# EAGLE design Smoker (EAGLE 6.5.0)
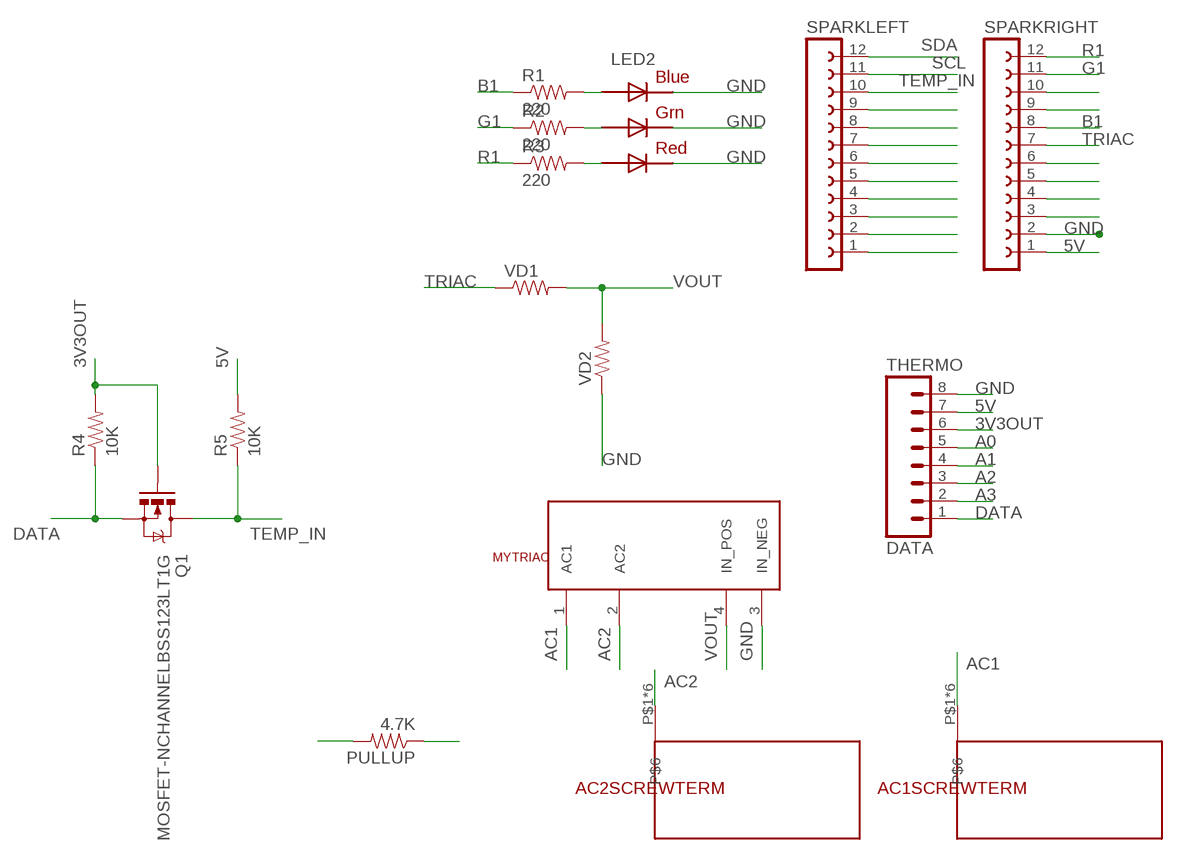
[diagram p0: schematic, sheet 1]

## Parts
AC1SCREWTERM  SCREW_TERM_8197  [SCREW_TERM_8197]
AC2SCREWTERM  SCREW_TERM_8197  [SCREW_TERM_8197]
LED2  RGBLED5050  [RGBLED5050]
MYTRIAC  S116S01  [S116S01]
PULLUP  4.7K  RESISTOR0805-RES  [0805]
Q1  MOSFET-NCHANNELBSS123LT1G  [SOT23]
R1  220  RESISTOR0805-RES  [0805]
R2  220  RESISTOR0805-RES  [0805]
R3  220  RESISTOR0805-RES  [0805]
R4  10K  RESISTOR0805-RES  [0805]
R5  10K  RESISTOR0805-RES  [0805]
SPARKLEFT  FE12-1  [FE12]
SPARKRIGHT  FE12-1  [FE12]
THERMO  DATA  M081X08  [1X08]
VD1  RESISTOR0805-RES  [0805]
VD2  RESISTOR0805-RES  [0805]

## Nets
3V3OUT: PULLUP.1 Q1.1(G) R4.2 THERMO.6
5V: R5.2 SPARKRIGHT.1 THERMO.7
A0: THERMO.5
A1: THERMO.4
A2: THERMO.3
A3: THERMO.2
AC1: AC1SCREWTERM.P$1 AC1SCREWTERM.P$2 AC1SCREWTERM.P$3 AC1SCREWTERM.P$4 AC1SCREWTERM.P$5 AC1SCREWTERM.P$6 MYTRIAC.1(AC1)
AC2: AC2SCREWTERM.P$1 AC2SCREWTERM.P$2 AC2SCREWTERM.P$3 AC2SCREWTERM.P$4 AC2SCREWTERM.P$5 AC2SCREWTERM.P$6 MYTRIAC.2(AC2)
B1: R1.1 SPARKRIGHT.8
DATA: PULLUP.2 Q1.2(S) R4.1 THERMO.1
G1: R2.1 SPARKRIGHT.11
GND: LED2.4(BLUE_C) LED2.5(RED_C) LED2.6(GREEN_C) MYTRIAC.3(IN_NEG) SPARKRIGHT.2 THERMO.8 VD2.1
N$1: LED2.3(BLUE_A) R1.2
N$2: LED2.1(GREEN_A) R2.2
N$3: SPARKRIGHT.3
N$4: SPARKRIGHT.4
N$5: LED2.2(RED_A) R3.2
N$6: SPARKLEFT.8
N$7: SPARKRIGHT.5
N$9: SPARKRIGHT.9
N$10: SPARKRIGHT.10
N$12: SPARKRIGHT.6
N$16: SPARKLEFT.9
N$18: SPARKLEFT.7
N$19: SPARKLEFT.6
N$20: SPARKLEFT.5
N$21: SPARKLEFT.4
N$22: SPARKLEFT.3
N$23: SPARKLEFT.2
N$24: SPARKLEFT.1
R1: R3.1 SPARKRIGHT.12
SCL: SPARKLEFT.11
SDA: SPARKLEFT.12
TEMP_IN: Q1.3(D) R5.1 SPARKLEFT.10
TRIAC: SPARKRIGHT.7 VD1.1
VOUT: MYTRIAC.4(IN_POS) VD1.2 VD2.2

## Library data of the parts
AC1SCREWTERM AC2SCREWTERM = mylib:SCREW_TERM_8197
LED2 = adafruit:RGBLED: For 5050 RGB LEDs, the order of the LEDs may vary from one manufacturer to another!
MYTRIAC = mylib:S116S01
PULLUP R4 R5 = SparkFun-Passives:RESISTOR: Resistor Basic schematic elements and footprints for 0603, 1206, and PTH resistors.
Q1 = SparkFun-DiscreteSemi:MOSFET-NCHANNEL: Common NMOSFET Parts MFG P/N Store ID Prod ID FDD8780 TRANS-09984 SI7820DN TRANS-11055 FDS6630A IC-08089 2N7002PW TRANS-11151 FQP30N06L COM-10213 TRANS-10060 BSS123LT1G TRANS-08345 BSS138 TRANS-00830 BS170 2N7000; PROD_ID: TRANS-08345
R1-R3 VD1 VD2 = SparkFun-Resistors:RESISTOR: Resistor Basic schematic elements and footprints for 0603, 1206, and PTH resistors.
SPARKLEFT SPARKRIGHT = con-lsta:FE12-1: FEMALE HEADER; OC_FARNELL: unknown; OC_NEWARK: unknown
THERMO = SparkFun-Connectors:M08: Header 8 Standard 8-pin 0.1" header. Use with straight break away headers (SKU : PRT-00116), right angle break away headers (PRT-00553), swiss pins (PRT-00743), machine pins (PRT-00117), and female headers (PRT-00115).

## Board
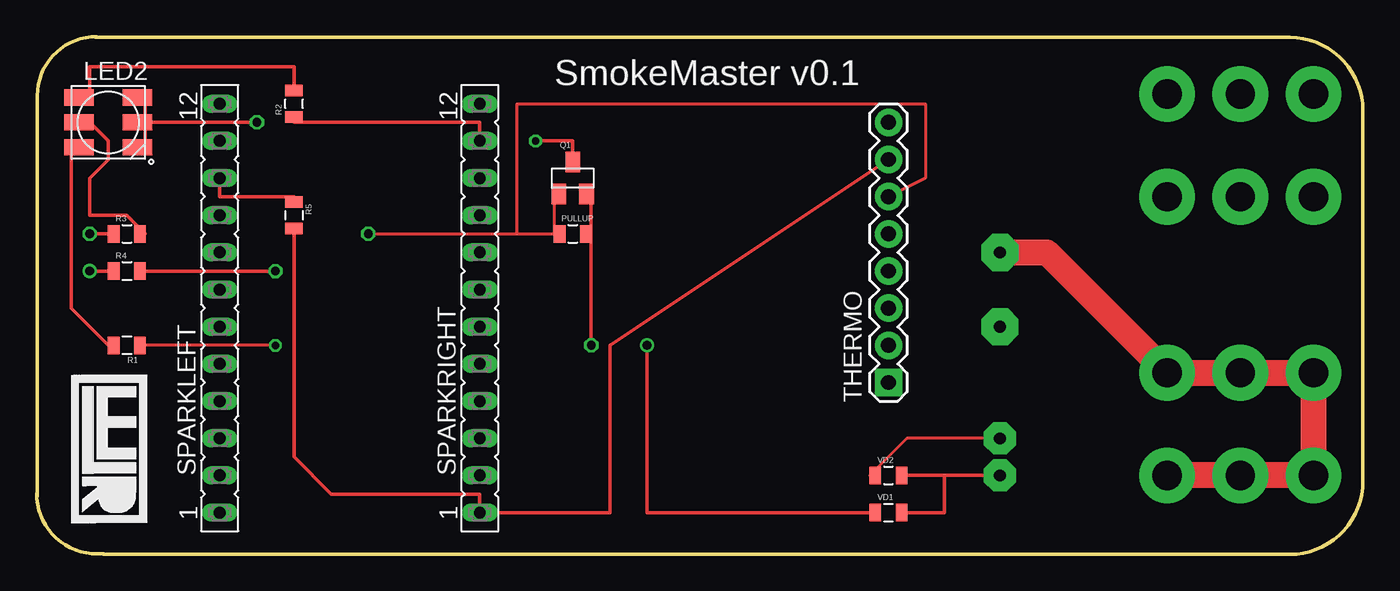
[diagram p1: board, top side]
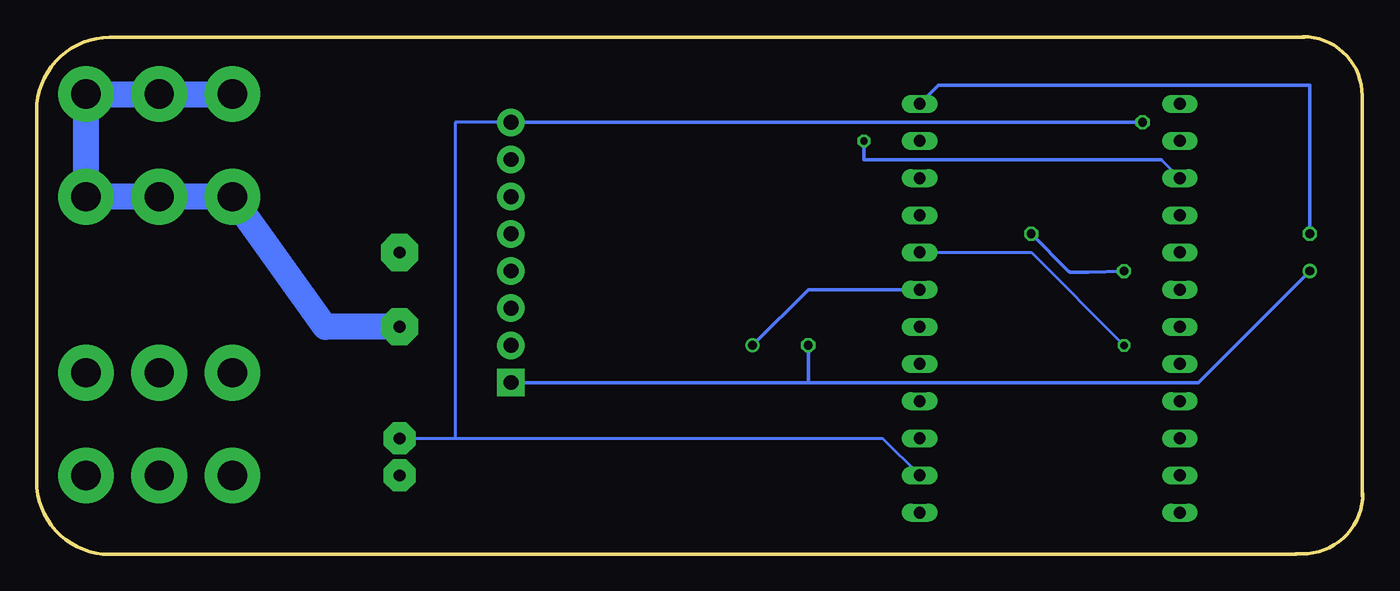
[diagram p2: board, bottom side, seen from below]

Size 90.68 x 35.39 mm. Coordinates in mm from the lower left corner, seen from the top.
Outline: 4.02,35.33 85.68,35.33 arc-90 90.68,30.33 90.68,5 arc-90 85.68,0 4.57,0
Outline: 4.1,35.39 arc90 0.05,31.33 0.05,3.98
Outline: 4.6,0.03 4.15,0.03 arc-90 0,4.18
Copper layers (1*16): Top 0.0356mm / dielectric 1.5011mm / Bottom 0.0356mm
Design rules "LaenPCBOrder": minimum track width 6mil, minimum drill 13mil, track to track 6mil, track to pad 6mil, pad to pad 6mil, via to via 6mil, smd to smd 6mil, copper to edge 15mil, drill to drill 6mil, minimum pad ring 7mil, minimum via ring 7mil, stop-mask expansion 3mil, vias tented up to drill 0mil, thermal gap 10mil

### Footprints (pad centres in the part's own frame; a part is rotated, then mirrored left to right if it is on the bottom)
SCREW_TERM_8197 = drill 2 pad 3.81: P$1 0,0; P$2 5.004,0; P$3 10.008,0; P$4 0,7.01; P$5 5.004,7.01; P$6 10.008,7.01
RGBLED5050 = smd 2 x 1.1: 1 -2,1.7; 2 -2,0; 3 -2,-1.7; 4 2,-1.7; 5 2,0; 6 2,1.7
S116S01 = drill 0.8 pad 2.54 octagon: 1 0,0; 2 5.08,0 | drill 0.8 pad 2.184 octagon: 3 12.71,0; 4 15.24,0
0805 = smd 0.8 x 1.2: 1 -0.9,0; 2 0.9,0
SOT23 = smd 1 x 1.4: 1 -0.95,-1.1; 2 0.95,-1.1; 3 0,1.1
FE12 = drill 0.813 long: 1 -13.97,0; 2 -11.43,0; 3 -8.89,0; 4 -6.35,0; 5 -3.81,0; 6 -1.27,0; 7 1.27,0; 8 3.81,0; 9 6.35,0; 10 8.89,0; 11 11.43,0; 12 13.97,0
1X08 = drill 1.016 pad 1.88 square: 1 0,0 | drill 1.016 pad 1.88: 2 2.54,0; 3 5.08,0; 4 7.62,0; 5 10.16,0; 6 12.7,0; 7 15.24,0; 8 17.78,0

### Placement (x,y rotation side)
AC1SCREWTERM  77.29,5.39 0 top
AC2SCREWTERM  77.29,24.44 0 top
LED2  4.9,29.52 0 top
MYTRIAC  65.86,20.63 270 top
PULLUP  36.65,21.9 0 top
Q1  36.65,25.71 0 top
R1  6.17,14.28 180 top
R2  17.6,30.79 90 top
R3  6.17,21.9 0 top
R4  6.17,19.36 0 top
R5  17.6,23.17 270 top
SPARKLEFT  12.52,16.82 90 top
SPARKRIGHT  30.3,16.82 90 top
THERMO  58.24,11.74 90 top
VD1  58.24,2.85 0 top
VD2  58.24,5.39 0 top

### Tracks (layer width: path | path; a pad name or v marks a point on that pad's centre or on a via)
3V3OUT  (via drill 0.6)
  Top 0.203: 35.38,21.9 35.38,24.44 Q1.1 | v22.68,21.9 32.84,21.9 | 32.84,21.9 35.38,21.9 | 35.38,21.9 PULLUP.1 | THERMO.6 60.78,25.71 60.78,30.79 32.84,30.79 32.84,21.9
  Top 0.254: R4.2 v16.33,19.36
  Bottom 0.254: v16.33,19.36 18.78,19.27 19.92,19.27 arc45 20.14,19.36 v22.68,21.9
5V
  Top 0.254: THERMO.7 39.19,14.28 39.19,2.85 SPARKRIGHT.1 30.3,4.12 20.14,4.12 17.6,6.66 R5.2
AC1
  Top 1.778: MYTRIAC.1 69.06,20.63 AC1SCREWTERM.P$4 AC1SCREWTERM.P$5 AC1SCREWTERM.P$6 AC1SCREWTERM.P$3 AC1SCREWTERM.P$2 AC1SCREWTERM.P$1
AC2
  Bottom 1.778: MYTRIAC.2 70.94,15.55 AC2SCREWTERM.P$1 AC2SCREWTERM.P$2 AC2SCREWTERM.P$3 AC2SCREWTERM.P$6 AC2SCREWTERM.P$5 AC2SCREWTERM.P$4
B1  (via drill 0.51)
  Top 0.203: v16.33,14.28 R1.1
  Bottom 0.203: v16.33,14.28 22.68,20.63 SPARKRIGHT.8
DATA  (via drill 0.61)
  Top 0.254: v3.63,19.36 R4.1 | v37.92,14.28 37.92,21.9 | 37.92,21.9 37.92,24.44 Q1.2 | 37.92,21.9 PULLUP.2
  Bottom 0.254: v3.63,19.36 11.25,11.74 37.92,11.74 | THERMO.1 37.92,11.74 | 37.92,11.74 v37.92,14.28
G1
  Top 0.254: SPARKRIGHT.11 30.3,29.52 17.6,29.52 R2.1
GND  (via drill 0.61)
  Top 0.203: VD2.1 56.97,5.39 59.51,7.93 MYTRIAC.3
  Top 0.254: 7.44,29.52 7.44,28.25 LED2.4 | 7.44,29.52 7.44,30.79 LED2.6 | v15.06,29.52 7.44,29.52 | 7.44,29.52 LED2.5
  Bottom 0.203: SPARKRIGHT.2 32.84,7.93 62.05,7.93 | MYTRIAC.3 62.05,7.93 | 62.05,7.93 62.05,29.52 THERMO.8
  Bottom 0.254: THERMO.8 v15.06,29.52
N$1
  Top 0.254: R1.2 4.9,14.28 2.36,16.82 2.36,28.25 LED2.3
N$2
  Top 0.254: R2.2 17.6,33.33 3.63,33.33 3.63,30.79 LED2.1
N$5
  Top 0.254: R3.2 7.44,21.9 6.17,23.17 3.63,23.17 3.63,25.71 4.9,26.98 4.9,28.25 3.63,29.52 LED2.2
R1  (via drill 0.61)
  Top 0.254: v3.63,21.9 R3.1
  Bottom 0.254: v3.63,21.9 3.63,32.06 29.03,32.06 SPARKRIGHT.12
TEMP_IN  (via drill 0.51)
  Top 0.254: SPARKLEFT.10 12.52,24.44 17.6,24.44 R5.1 | v34.11,28.25 36.65,28.25 Q1.3
  Bottom 0.203: SPARKLEFT.10 13.79,26.98
  Bottom 0.254: v34.11,28.25 34.11,26.98 13.79,26.98
TRIAC  (via drill 0.61)
  Top 0.254: v41.73,14.28 41.73,2.85 VD1.1
  Bottom 0.254: v41.73,14.28 37.92,18.09 SPARKRIGHT.7
VOUT
  Top 0.254: 62.05,5.39 62.05,2.85 VD1.2 | 62.05,5.39 VD2.2 | MYTRIAC.4 62.05,5.39

### Text on the board
tPlace: SmokeMaster v0.1